# Altium project PCB_Project1.PrjPCB
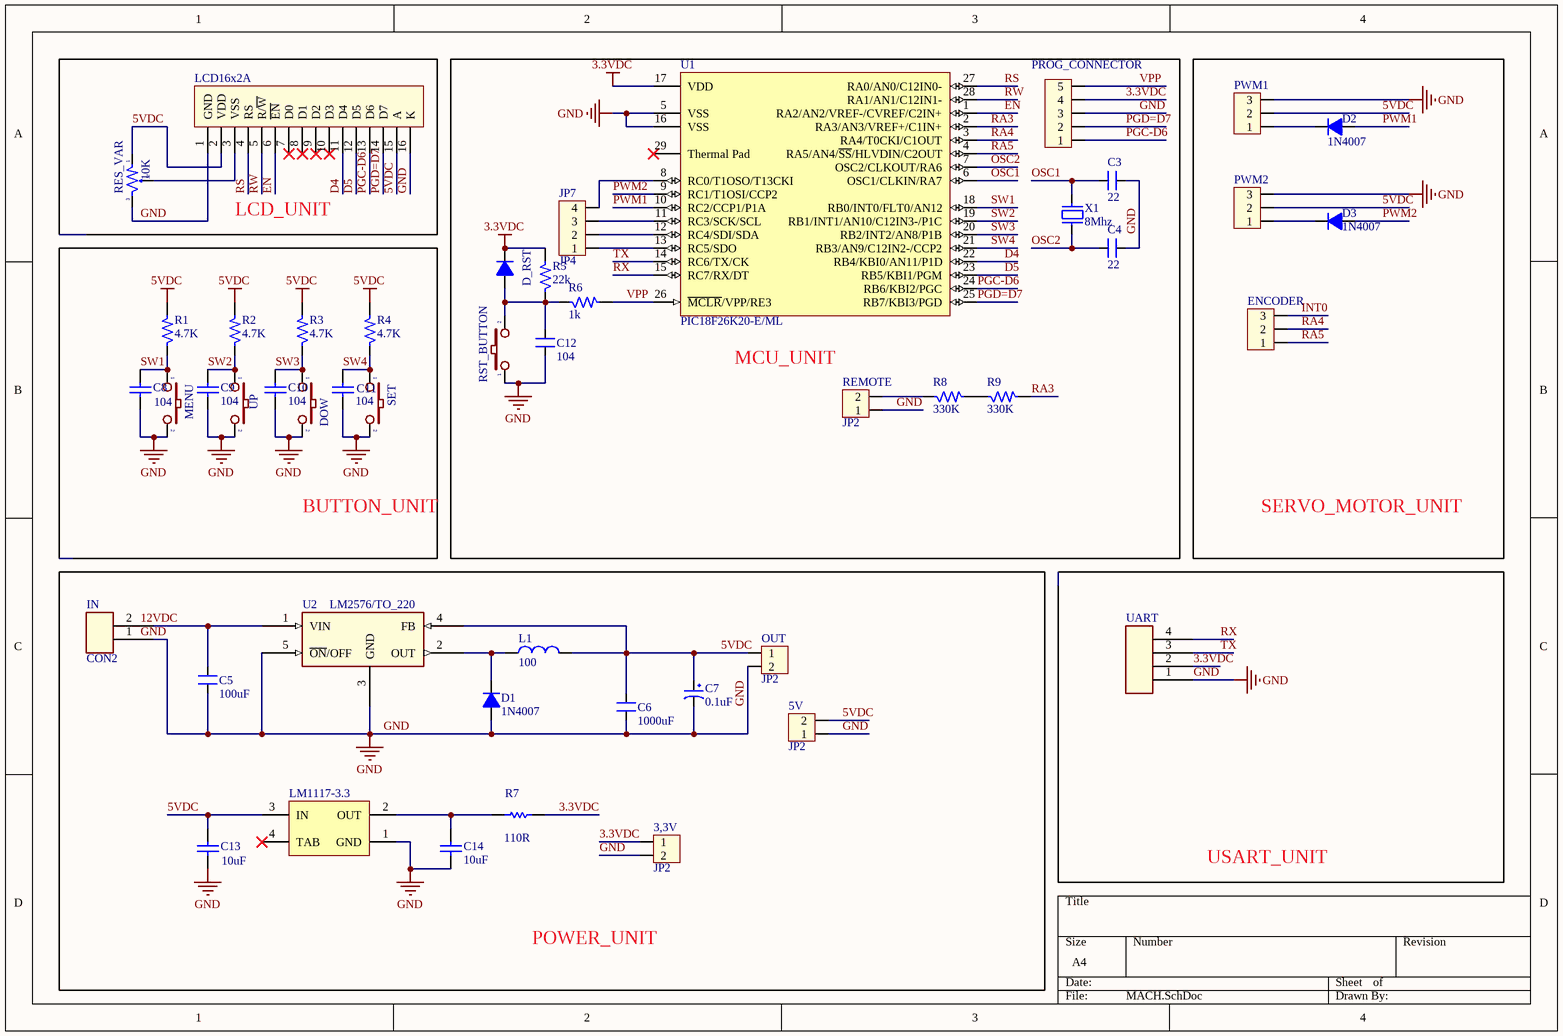
[diagram p0: MACH.SchDoc]
1 sheet, 48 parts. Net scope: global (net labels, ports and power ports of the same name join across sheets).
Board file: PCB1.PcbDoc

## Sheet MACH.SchDoc: Motorized Head
size A4; Date: 29 - 11 - 2013; Author: Chu Trong Khanh; DrawnBy: Chu Trong Khanh

### Parts
3,3V  JP2  [CON2]
5V  JP2  [CON2]
C3  22  [SM-0805]
C4  22  [SM-0805]
C5  100uF  [CP1/2.5_SM]
C6  1000uF  [CP2/4]
C7  0.1uF  [CP1/2]
C8  value 104  [SM-0805]  (hidden comment: Cap)
C9  value 104  [SM-0805]  (hidden comment: Cap)
C10  value 104  [SM-0805]  (hidden comment: Cap)
C11  value 104  [SM-0805]  (hidden comment: Cap)
C12  104  [SM-0805]
C13  value 10uF  [CP1/2]  (hidden comment: Cap)
C14  value 10uF  [CP1/2]  (hidden comment: Cap)
D1  1N4007  [D2AN]
D2  1N4007  [D2A]
D3  1N4007  [D2A]
D_RST  1N5408  [D2A]  (value not drawn)
DOW  SW  [SW2]  (value not drawn)
ENCODER  JP3  [CON3]  (value not drawn)
IN  CON2  [CON2]
JP7  JP4  [CON4]
L1  100  [L/0.4]
LCD16x2A  LCD  [LCD16X2]  (value not drawn)
LM1117-3.3  LM1117MP-1.2  [LM1117-SOP]  (value not drawn)
MENU  SW  [SW2]  (value not drawn)
OUT  JP2  [CON2]
PROG_CONNECTOR  (no value)  [CON5]
PWM1  JP3  [CON3]  (value not drawn)
PWM2  JP3  [CON3]  (value not drawn)
R1  4.7K  [SM-0805]
R2  4.7K  [SM-0805]
R3  4.7K  [SM-0805]
R4  4.7K  [SM-0805]
R5  22k  [SM-0805]
R6  1k  [SM-0805]
R7  value 110R  [SM-0805]  (hidden comment: Res1)
R8  330K  [SM-1206]
R9  330K  [SM-1206]
REMOTE  JP2  [CON2]
RES_VAR  10K  [VR]
SET  SW  [SW2]  (value not drawn)
SW0  RST_BUTTON  [SW2]
U1  PIC18F26K20-E/ML  [SOP_28M_127]
U2  LM2576/TO_220  [LM2576_SMD]
UART  CON4  [CON4]  (value not drawn)
UP  SW  [SW2]  (value not drawn)
X1  8Mhz  [XT2]

### Blocks framed on the sheet
MCU_UNIT: C3 C4 C12 D_RST JP7 PROG_CONNECTOR R5 R6 R8 R9 REMOTE SW0 U1 X1
SERVO_MOTOR_UNIT: D2 D3 ENCODER PWM1 PWM2
POWER_UNIT: 3,3V 5V C5-C7 C13 C14 D1 IN L1 LM1117-3.3 OUT R7 U2

### Nets
3.3VDC: 3,3V.1 D_RST.2(K) PROG_CONNECTOR.4 R5.2 R7.2 U1.17(VDD) UART.2
5VDC: 5V.2 C6.2 C7.1 C13.2 L1.2 LCD16x2A.2(VDD) LCD16x2A.15(A) LM1117-3.3.3(IN) OUT.1 PWM1.2 PWM2.2 R1.2 R2.2 R3.2 R4.2 RES_VAR.1 U2.4(FB)
GND: 3,3V.2 5V.1 C3.1 C4.1 C5.1 C6.1 C7.2 C8.1 C9.1 C10.1 C11.1 C12.1 C13.1 C14.1 D1.1(A) DOW.2 IN.1 LCD16x2A.1(GND) LCD16x2A.16(K) LM1117-3.3.1(GND) MENU.2 OUT.2 PROG_CONNECTOR.3 PWM1.3 PWM2.3 REMOTE.1 RES_VAR.3 SET.2 SW0.1 U1.5(VSS) U1.16(VSS) U2.3(GND) U2.5(~{ON}/OFF) UART.1 UP.2
D4: LCD16x2A.11(D4) U1.22(RB4/KBI0/AN11/P1D)
D5: LCD16x2A.12(D5) U1.23(RB5/KBI1/PGM)
EN: LCD16x2A.6(~{EN}) U1.1(RA2/AN2/VREF-/CVREF/C2IN+)
INT0: ENCODER.3
OSC1: C3.2 U1.6(OSC1/CLKIN/RA7) X1.2
OSC2: C4.2 U1.7(OSC2/CLKOUT/RA6) X1.1
PGC-D6: LCD16x2A.13(D6) PROG_CONNECTOR.1 U1.24(RB6/KBI2/PGC)
PGD=D7: LCD16x2A.14(D7) PROG_CONNECTOR.2 U1.25(RB7/KBI3/PGD)
PWM1: D2.1(A) U1.10(RC2/CCP1/P1A)
PWM2: D3.1(A) U1.9(RC1/T1OSI/CCP2)
RA3: R9.2 U1.2(RA3/AN3/VREF+/C1IN+)
RA4: ENCODER.2 U1.3(RA4/T0CKI/C1OUT)
RA5: ENCODER.1 U1.4(RA5/AN4/~{SS}/HLVDIN/C2OUT)
RS: LCD16x2A.4(RS) U1.27(RA0/AN0/C12IN0-)
RW: LCD16x2A.5(R/~{W}) U1.28(RA1/AN1/C12IN1-)
RX: U1.15(RC7/RX/DT) UART.4
SW1: C8.2 MENU.1 R1.1 U1.18(RB0/INT0/FLT0/AN12)
SW2: C9.2 R2.1 U1.19(RB1/INT1/AN10/C12IN3-/P1C) UP.1
SW3: C10.2 DOW.1 R3.1 U1.20(RB2/INT2/AN8/P1B)
SW4: C11.2 R4.1 SET.1 U1.21(RB3/AN9/C12IN2-/CCP2)
TX: U1.14(RC6/TX/CK) UART.3
VPP: PROG_CONNECTOR.5 R6.2 U1.26(~{MCLR}/VPP/RE3)
NetC5_2: C5.2 IN.2 U2.1(VIN)
NetC12_2: C12.2 D_RST.1(A) R5.1 R6.1 SW0.2
NetC14_2: C14.2 LM1117-3.3.2(OUT) R7.1
NetD1_2: D1.2(K) L1.1 U2.2(OUT)
NetD2_2: D2.2(K) PWM1.1
NetD3_2: D3.2(K) PWM2.1
NetJP7_1: JP7.1 U1.13(RC5/SDO)
NetJP7_2: JP7.2 U1.12(RC4/SDI/SDA)
NetJP7_3: JP7.3 U1.11(RC3/SCK/SCL)
NetJP7_4: JP7.4 U1.8(RC0/T1OSO/T13CKI)
NetLCD16x2A_3: LCD16x2A.3(VSS) RES_VAR.2
NetR8_1: R8.1 REMOTE.2
NetR8_2: R8.2 R9.1

Not connected (* = marked no-connect by the designer): LCD16x2A 7(D0)* 8(D1)* 9(D2)* 10(D3)*; LM1117-3.3 4(TAB)*; U1 29(Thermal_Pad)*

### Notes on the sheet
- LCD_UNIT
- BUTTON_UNIT
- USART_UNIT
- Labels drawn without touching a wire or pin: 12VDC, GND

### Library data of the parts
3,3V 5V OUT REMOTE = Con2: Connector 2; Value: Connector 2
C3-C6 C12 = CM: Cap SMD; Value: 103
C7 = CP1: Cap P  0,1uF < 22uF , 16 - 50V; Value: 10uF/50V; Description 1: 10 => 220uF/6,3V/10V - 10uF => 100uF/16V; Description 2: 0,1uF => 33uF/50V - 10uF => 22uF/63V; Description 3: 0,47uF => 10uF/100V
C8-C11 C13 C14 = Cap: Capacitor; Published: 8-Jun-2000; LatestRevisionDate: 17-Jul-2002; LatestRevisionNote: Re-released for DXP Platform.; PackageReference: RAD-0.3; Publisher: Altium Limited; PackageDescription: Radial Cap, Thru-Hole; 2 Leads; 0.3 in Pin Spacing
D1-D3 = D1A: Diode 1A; Value: 1N4007
D_RST = D5A: Diode 5A; Value: 1N5408
DOW MENU SET SW0 UP = SW2: Switch button 2 pin; Value: SW chip 2 pin
ENCODER PWM1 PWM2 = Con3: Connector 3; Value: Connector 3
JP7 = Con4: Connector 4; Value: Connector 4
L1 = L1: Inductor; Value: 150 mH
LCD16x2A = LCD16x2: LCD dipslay 16 char, 2 line; Value: LCD16x2A
LM1117-3.3 = LM1117MP-2.5: 800mA Low-Dropout Linear Regulator; Manufacturer: National Semiconductor; CompType: LDO IC; PackageTopMarking: XYTT*N13A; PowerWise: N; Published: 4-Dec-2008; DatasheetVersion: Apr-2006; PackageVersion: revB, Apr-2003; PackageReference: MP04A; Publisher: Altium Limited; PackageDescription: Molded SOT-223, 6.50 x 3.56 x 1.6mm Body, 4 Lead, 2.3mm Pitch; PartNumber: LM1117MP-2.5; RoHS: O; PinCount: 4; DigiKeyPartNumber: LM1117MP-2.5-ND; Code_JEDEC: TO-261-AA; Code_IPC: SOT223-4; ComponentLink1Description: LM1117 Datasheet; ComponentLink1URL: http://www.national.com/ds/LM/LM1117.pdf; ComponentLink2Description: LM1117 Web Page; ComponentLink2URL: http://www.national.com/pf/LM/LM1117.html; ComponentLink3Description: MP04A Package Page; ComponentLink3URL: http://www.national.com/packaging/folders/mp04a.html
PROG_CONNECTOR = Con5: Connector 5; Value: Connector 5
R1-R6 R8 R9 = R: Resistor 1/4W; Value: R1/4W - 1K
R7 = Res1: Resistor; Published: 8-Jun-2000; LatestRevisionDate: 17-Jul-2002; LatestRevisionNote: Re-released for DXP Platform.; PackageReference: AXIAL-0.3; Publisher: Altium Limited; PackageDescription: Axial Device, Thru-Hole; 2 Leads; 0.3 in Pin Spacing
RES_VAR = VOL-S: Var Resistor; Value: Volume 50k
U1 = PIC18F26K20-E/ML: Flash Microcontroller with 10-Bit A/D and nanoWatt Technology, 64K Flash, 28-Pin QFN, Extended Temperature Range; FirstPublished: 29-Jan-2009; LatestRevisionDate: 02-Dec-2009; LatestRevisionNote: Updated to datasheet revision F, Sep-2009; DatasheetVersion: revF, Sep-2009; PackageVersion: revBB, Aug-2009; PackageReference: QFN-ML28; Publisher: Altium Limited; PackageDescription: 28-Lead Plastic Quad Flat, No Lead Package (ML) - 6x6 mm Body [QFN] with 0.55 mm Contact Length; Supplier 1: Digi-Key; Supplier Part Number 1: PIC18F26K20-E/ML-ND; Supplier 2: Farnell; Supplier Part Number 2: 1695552; Supplier 3: Newark; Supplier Part Number 3: 88K6000; Code_JEDEC: MO-220; Code_IPC: QFN65P600X600-28V; ComponentLink1Description: Datasheet; ComponentLink1URL: http://ww1.microchip.com/downloads/en/DeviceDoc/41303F.pdf; ComponentLink2Description: Packaging Specification; ComponentLink2URL: http://www.microchip.com/stellent/groups/techpub_sg/documents/packagingspec/en012702.pdf; ComponentLink3Description: Microchip.com Home; ComponentLink3URL: http://www.microchip.com/
UART = CON4: 4-Pin Connector; pitch 2.54mm
X1 = XT2: Crystal For all Crystal 2pin.; Value: 4Mhz